# EAGLE schematic Lab5Experimental (EAGLE 9.2.0)
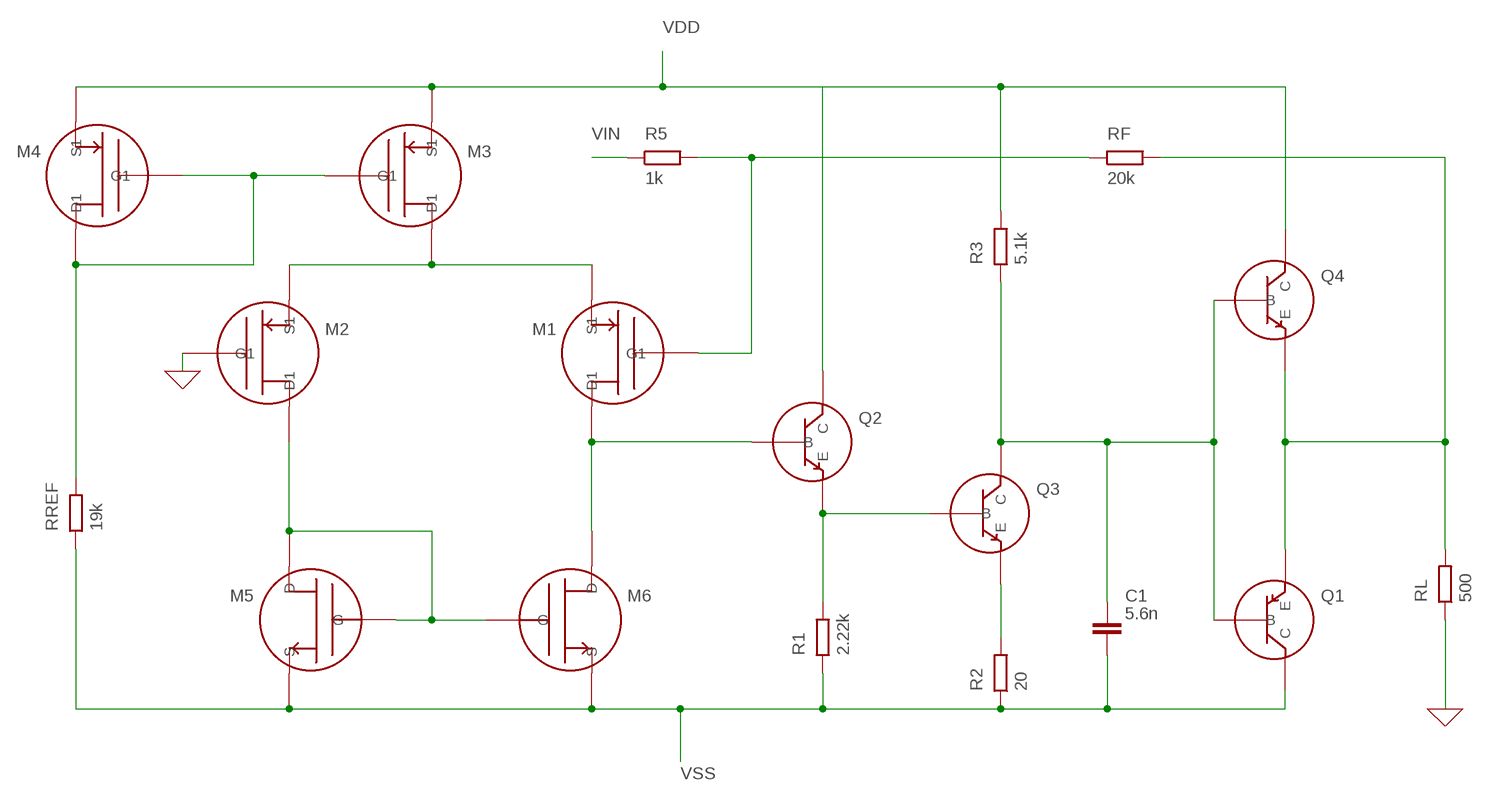
[diagram p0: schematic, sheet 1]

## Parts
C1  5.6n  C  (no package)
M1  FET_P  (no package)
M2  FET_P  (no package)
M3  FET_P  (no package)
M4  FET_P  (no package)
M5  FET_N  (no package)
M6  FET_N  (no package)
Q1  BJT_PNP  (no package)
Q2  BJT_NPN  (no package)
Q3  BJT_NPN  (no package)
Q4  BJT_NPN  (no package)
R1  2.22k  R  (no package)
R2  20  R  (no package)
R3  5.1k  R  (no package)
R5  1k  R  (no package)
RF  20k  R  (no package)
RL  500  R  (no package)
RREF  19k  R  (no package)

## Nets
0: M2.G1 RL.1 ; supply symbol labelled GND
N$1: M3.G1 M4.D1 M4.G1 RREF.2
N$2: M1.G1 R5.2 RF.1
N$4: Q1.E Q4.E RF.2 RL.2
N$6: M2.D1 M5.D M5.G M6.G
N$7: M1.S1 M2.S1 M3.D1
N$9: M1.D1 M6.D Q2.B
N$12: C1.1 Q1.B Q3.C Q4.B R3.1
N$13: Q3.E R2.2
N$14: Q2.E Q3.B R1.2
VDD: M3.S1 M4.S1 Q2.C Q4.C R3.2
VIN: R5.1
VSS: C1.2 M5.S M6.S Q1.C R1.1 R2.1 RREF.1

## Library data of the parts
C1 = ngspice-simulation:C: CAPACITOR
M1-M4 = ngspice-simulation:FET_P: P-Type MOS Field Effect Transistor (MOSFET)
M5 M6 = ngspice-simulation:FET_N: N-Type MOS Field Effect Transistor (MOSFET)
Q1 = ngspice-simulation:BJT_PNP: Bipolar PNP Transistor
Q2-Q4 = ngspice-simulation:BJT_NPN: Bipolar NPN Transistor
R1-R3 R5 RF RL RREF = ngspice-simulation:R: RESISTOR